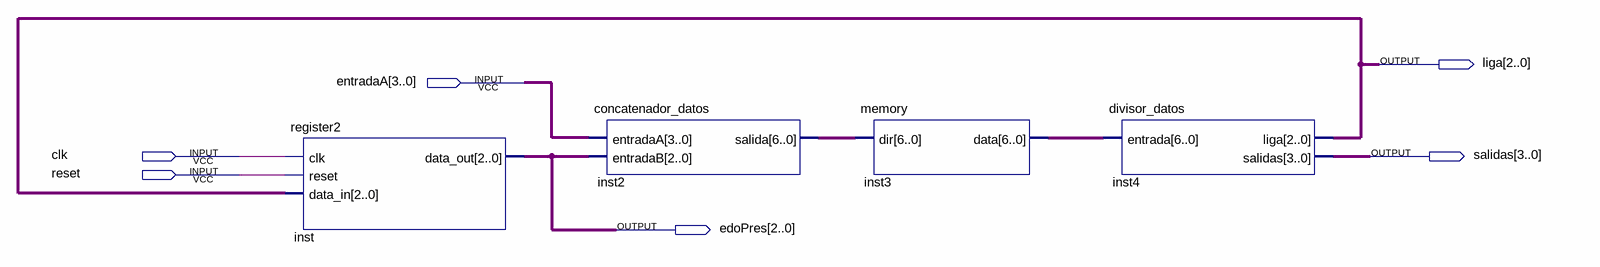
[diagram p0: schematic sheet]
// Quartus schematic practica3.bdf as structural Verilog: 4 symbols, 6 pins
module practica3 (
  input  [3:0] entradaA,
  input  clk,
  input  reset,
  output [2:0] liga,
  output [3:0] salidas,
  output [2:0] edoPres
);

  wire [6:0] inst2_salida, inst3_data;

  register2 inst (.clk(clk), .reset(reset), .data_in(liga), .data_out(edoPres));
  concatenador_datos inst2 (.entradaA(entradaA), .entradaB(edoPres), .salida(inst2_salida));
  memory inst3 (.dir(inst2_salida), .data(inst3_data));
  divisor_datos inst4 (.entrada(inst3_data), .liga(liga), .salidas(salidas));
endmodule
